# EAGLE design SwitchNode Shield (EAGLE 7.2.0)
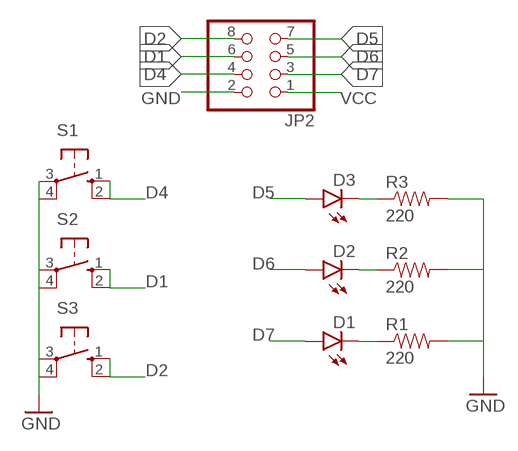
[diagram p0: schematic, sheet 1]

## Parts
D1  LED3MM  [LED3MM]
D2  LED3MM  [LED3MM]
D3  LED3MM  [LED3MM]
JP2  PINHD-2X4  [2X04]
R1  220  RESISTORAXIAL-0.3  [AXIAL-0.3]
R2  220  RESISTORAXIAL-0.3  [AXIAL-0.3]
R3  220  RESISTORAXIAL-0.3  [AXIAL-0.3]
S1  40-XX  [B3F-40XX]
S2  40-XX  [B3F-40XX]
S3  40-XX  [B3F-40XX]

## Nets
D1: JP2.6 S2.1(S) S2.2(S1)
D2: JP2.8 S3.1(S) S3.2(S1)
D4: JP2.4 S1.1(S) S1.2(S1)
D5: D3.A JP2.7
D6: D2.A JP2.5
D7: D1.A JP2.3
GND: JP2.2 R1.P$2 R2.P$2 R3.P$2 S1.3(P) S1.4(P1) S2.3(P) S2.4(P1) S3.3(P) S3.4(P1)
N$3: D3.K(C) R3.P$1
N$5: D2.K(C) R2.P$1
N$8: D1.K(C) R1.P$1
VCC: JP2.1

## Library data of the parts
D1-D3 = SparkFun-LED:LED: LEDs Standard schematic elements and footprints for 5mm, 3mm, 1206, and 0603 sized LEDs. 5mm - Spark Fun Electronics SKU : COM-00529 (and others)
JP2 = adafruit:PINHD-2X4: PIN HEADER
R1-R3 = SparkFun-Resistors:RESISTOR: Resistor Basic schematic elements and footprints for 0603, 1206, and PTH resistors.
S1-S3 = switch-omron:40-XX: OMRON SWITCH; MF: OMRON COMPONENTS USA; MPN: B3F-4000; OC_FARNELL: 176434; OC_NEWARK: 36K3105

## Board
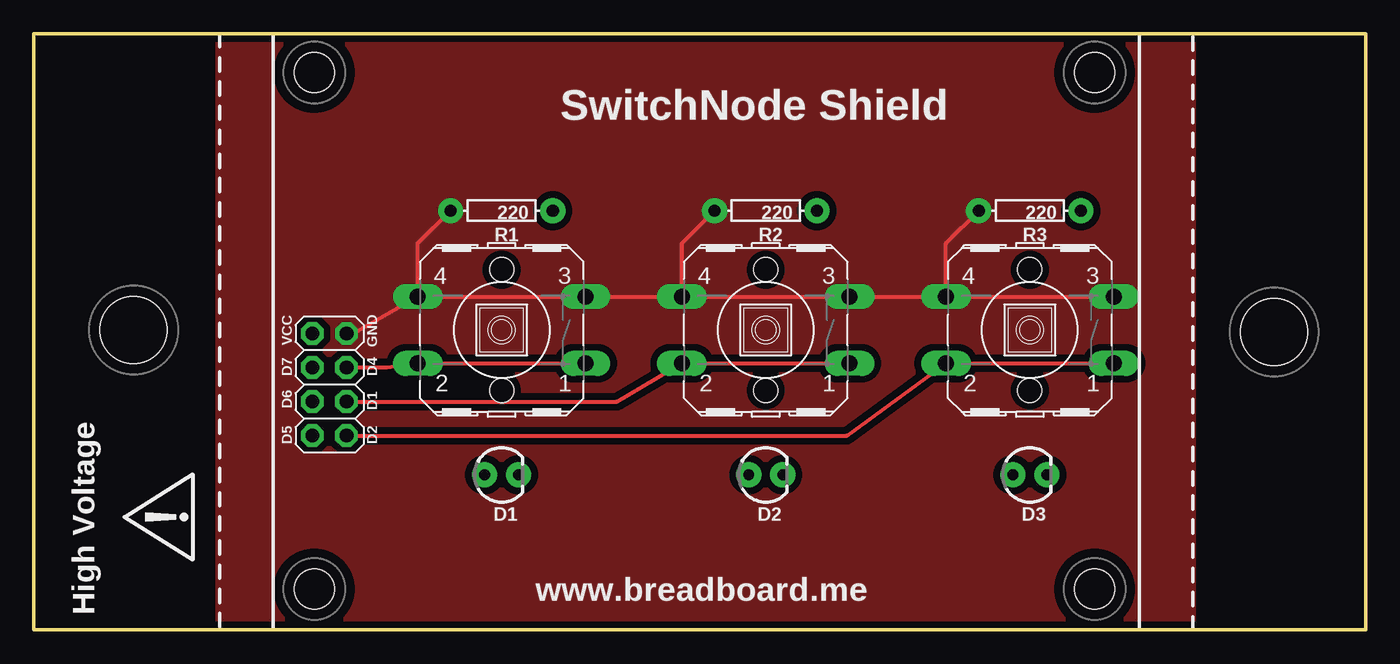
[diagram p1: board, top side]
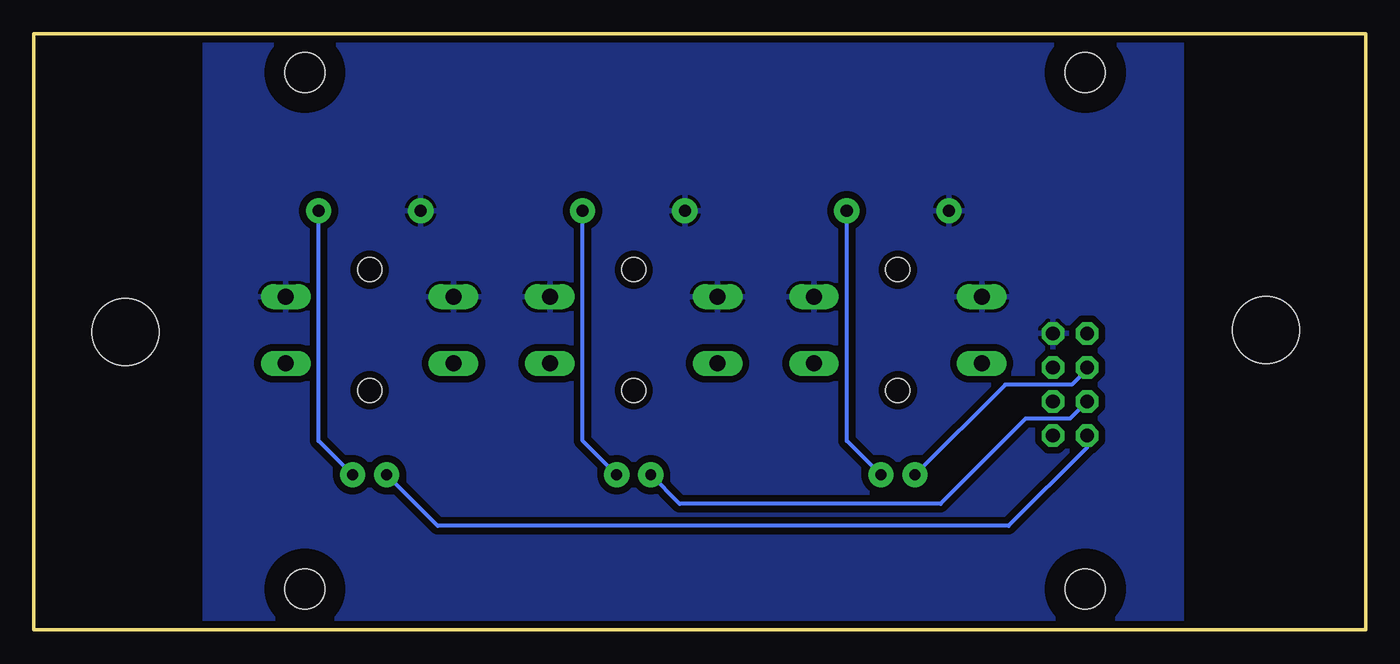
[diagram p2: board, bottom side, seen from below]

Size 99.32 x 44.44 mm. Coordinates in mm from the lower left corner, seen from the top.
Outline: 99.32,44.44 0,44.44 0,0 99.32,0 99.32,44.44
Copper layers (1*16): Top 0.035mm / dielectric 1.5mm / Bottom 0.035mm
Design rules "default *": minimum track width 10mil, minimum drill 24mil, track to track 10mil, track to pad 10mil, pad to pad 10mil, via to via 10mil, smd to smd 8mil, copper to edge 20mil, drill to drill 12mil, minimum pad ring 13mil, minimum via ring 10mil, stop-mask expansion 4mil, vias tented up to drill 0mil, thermal gap 10mil

### Footprints (pad centres in the part's own frame; a part is rotated, then mirrored left to right if it is on the bottom)
LED3MM = drill 0.813 pad 1.88: A -1.27,0; K 1.27,0
2X04 = drill 1.016 pad 1.676 octagon: 1 -3.81,-1.27; 2 -3.81,1.27; 3 -1.27,-1.27; 4 -1.27,1.27; 5 1.27,-1.27; 6 1.27,1.27; 7 3.81,-1.27; 8 3.81,1.27
AXIAL-0.3 = drill 0.9 pad 1.88: P$1 -3.81,0; P$2 3.81,0
B3F-40XX = drill 1.194 long: 1 -6.248,2.489; 2 6.248,2.489; 3 -6.248,-2.489; 4 6.248,-2.489 | hole 1.803: 0,-4.496; 0,4.496
KFH-M5 = hole 5: 0,0
KFH-M3 = hole 3: 0,0

### Placement (x,y rotation side)
D1  34.89,11.56 0 top
D2  54.58,11.56 0 top
D3  74.26,11.56 0 top
JP2  22.07,18.29 270 top
R1  34.89,31.24 180 top
R2  54.58,31.24 180 top
R3  74.26,31.24 180 top
S1  34.89,22.35 180 top
S2  54.58,22.35 180 top
S3  74.26,22.35 180 top
U$1  [KFH-M5]  7.46,22.34 0 top
U$2  [KFH-M5]  92.46,22.21 0 top
U$3  [ICON_EXL-S]  9.95,8.42 90 top
U$6  [KFH-M3]  20.92,3.05 0 top
U$7  [KFH-M3]  79.09,3.05 0 top
U$8  [KFH-M3]  79.09,41.53 0 top
U$9  [KFH-M3]  20.92,41.53 0 top

### Tracks (layer width: path | path; a pad name or v marks a point on that pad's centre or on a via)
D1
  Top 0.305: JP2.6 43.48,17.02 S2.2 S2.1
D2
  Top 0.305: JP2.8 60.63,14.48 S3.2 S3.1
D4
  Top 0.305: JP2.4 26.34,19.56 S1.2 S1.1
D5
  Bottom 0.305: JP2.7 20.8,13.59 26.64,7.75 69.18,7.75 D3.A
D6
  Bottom 0.305: JP2.5 22.07,15.75 25.37,15.75 31.72,9.4 51.15,9.4 D2.A
D7
  Bottom 0.305: JP2.3 20.8,19.43 21.94,18.29 26.89,18.29 D1.A
GND
  Top 0.305: JP2.2 23.9,22.1 S1.4 | S1.4 S1.3 S2.4 | S2.4 S2.3 S3.4 | S3.4 S3.3 | S1.4 28.65,28.8 R1.P$2 | S2.4 48.33,28.8 R2.P$2 | S3.4 68.02,28.8 R3.P$2
  pour Bottom (isolate 0.508): 13.76,47.12 86.54,47.34 86.54,-4.09 13.76,-4.32
  pour Top (isolate 0.508, no thermals): 13.76,47.12 86.47,47.22 86.47,-4.21 13.76,-4.32
N$3
  Bottom 0.305: D3.K 78.07,14.1 R3.P$1
N$5
  Bottom 0.305: D2.K 58.39,14.1 R2.P$1
N$8
  Bottom 0.305: D1.K 38.7,14.1 R1.P$1

### Text on the board
tNames: SwitchNode Shield | VCC | GND | D7 | D4 | D6 | D1 | D5 | D2 | www.breadboard.me | High Voltage